# EAGLE design TMK-EURO-0.1.1x (EAGLE 8.1.0)
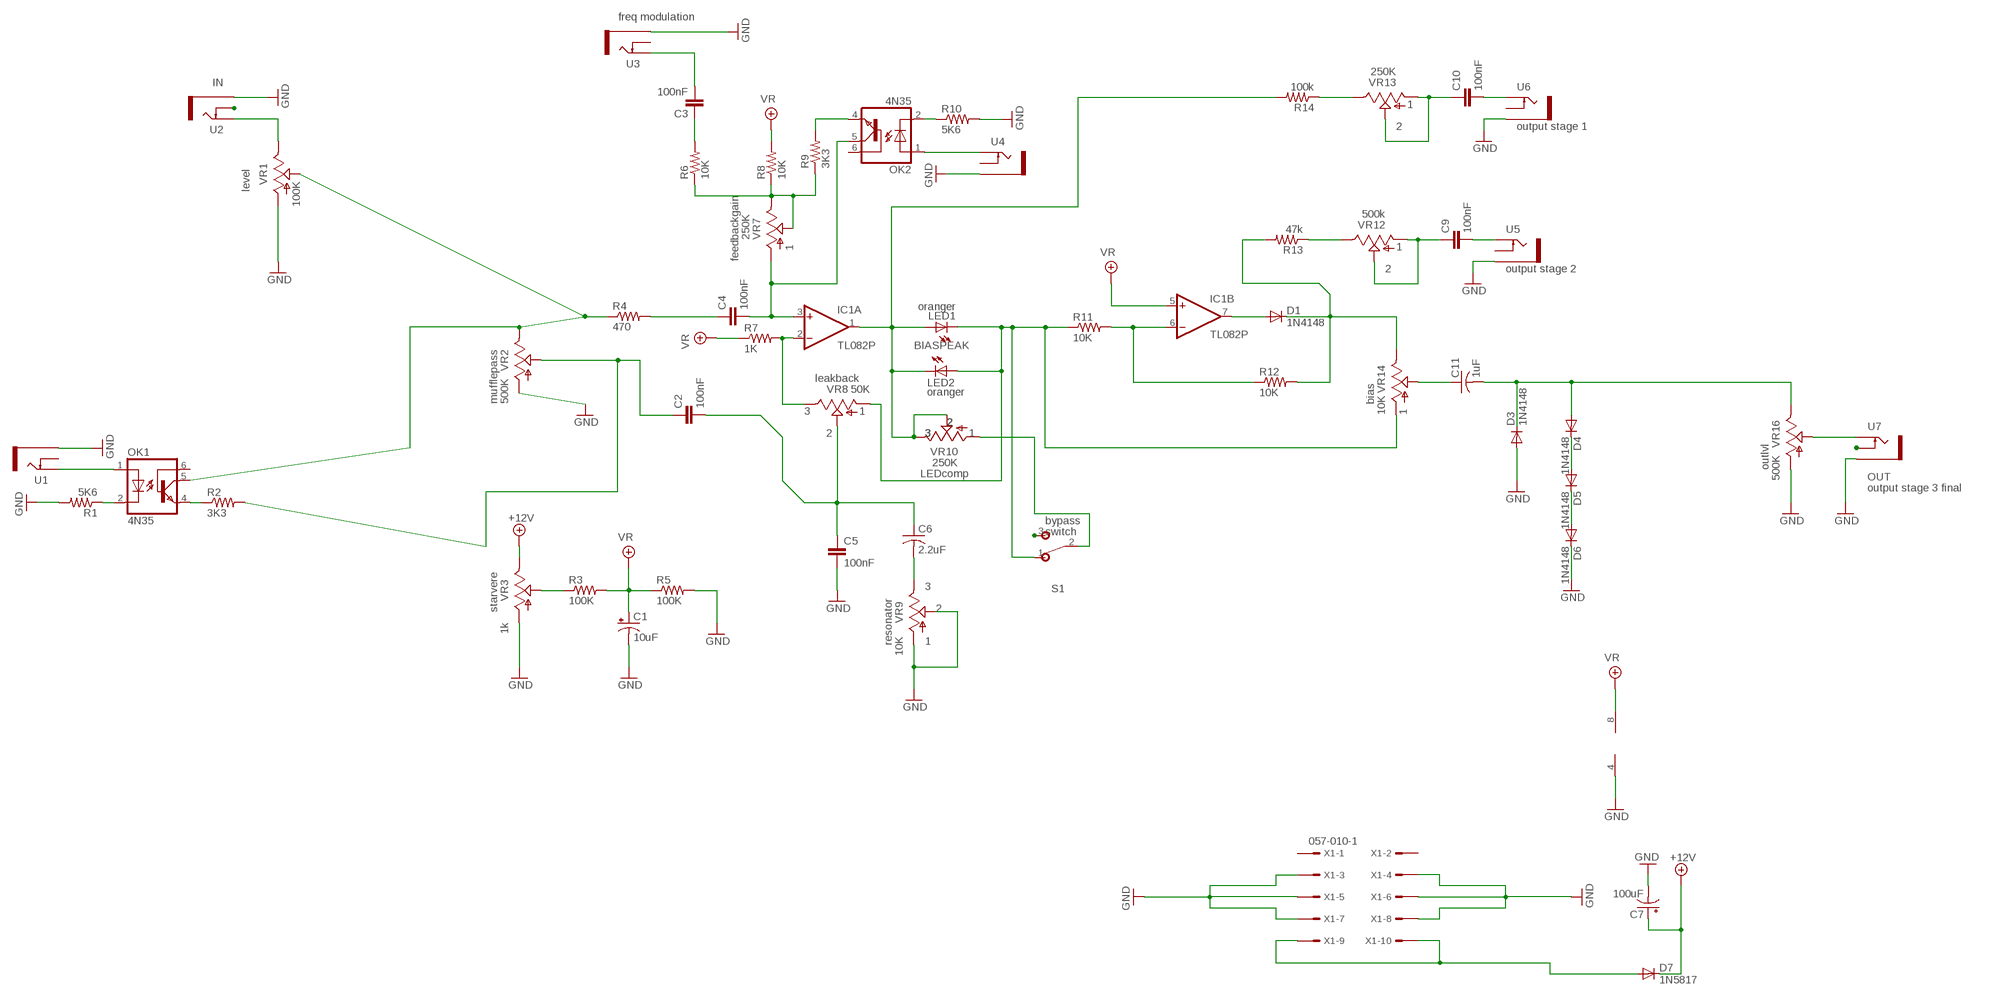
[diagram p0: schematic, sheet 1]

## Parts
C1  10uF  CPOL-USE2-5  [E2-5]
C2  100nF  C-EU050-035X075  [C050-035X075]
C3  100nF  C-EU050-035X075  [C050-035X075]
C4  100nF  C-EU050-035X075  [C050-035X075]
C5  100nF  C-EU050-035X075  [C050-035X075]
C6  2.2uF  C-US050-030X075  [C050-030X075]
C7  100uF  080  [080_035]
C9  100nF  C-EU050-035X075  [C050-035X075]
C10  100nF  C-EU050-035X075  [C050-035X075]
C11  1uF  C-US050-075X075  [C050-075X075]
D1  1N4148  SMALL_DIODEDO35-7  [DO35-7]
D3  1N4148  SMALL_DIODEDO35-7  [DO35-7]
D4  1N4148  SMALL_DIODEDO35-7  [DO35-7]
D5  1N4148  SMALL_DIODEDO35-7  [DO35-7]
D6  1N4148  SMALL_DIODEDO35-7  [DO35-7]
D7  1N5817  SMALL_DIODEDO35-7  [DO35-7]
IC1  TL082P  [DIL08]
LED1  oranger  LED3MM  [LED3MM]
LED2  oranger  LED3MM  [LED3MM]
OK1  4N35  [DIL06]
OK2  4N35  [DIL06]
R1  5K6  R-US_0207/7  [0207/7]
R2  3K3  R-US_0207/7  [0207/7]
R3  100K  R-US_0207/7  [0207/7]
R4  470  R-US_0207/7  [0207/7]
R5  100K  R-US_0207/7  [0207/7]
R6  10K  R-US_0207/7  [0207/7]
R7  1K  R-US_0207/7  [0207/7]
R8  10K  R-US_0207/7  [0207/7]
R9  3K3  R-US_0207/7  [0207/7]
R10  5K6  R-US_0207/7  [0207/7]
R11  10K  R-US_0207/7  [0207/7]
R12  10K  R-US_0207/7  [0207/7]
R13  47k  R-US_0207/7  [0207/7]
R14  100k  R-US_0207/7  [0207/7]
S1  SPDTPADS  [SPDT]
U1  IN  THONKICONNOLD  [THONKICONN]
U2  IN  THONKICONNOLD  [THONKICONN]
U3  IN  THONKICONNOLD  [THONKICONN]
U4  IN  THONKICONNOLD  [THONKICONN]
U5  IN  THONKICONNOLD  [THONKICONN]
U6  IN  THONKICONNOLD  [THONKICONN]
U7  THONKICONNOLD  [THONKICONN]
VR1  100K  9MM_SNAP-IN_POT_  [9MM_SNAP-IN_POT]
VR2  500K  9MM_SNAP-IN_POT_  [9MM_SNAP-IN_POT]
VR3  1k  9MM_SNAP-IN_POT_  [9MM_SNAP-IN_POT]
VR7  250K  9MM_SNAP-IN_POT_  [9MM_SNAP-IN_POT]
VR8  50K  9MM_SNAP-IN_POT_  [9MM_SNAP-IN_POT]
VR9  10K  9MM_SNAP-IN_POT_  [9MM_SNAP-IN_POT]
VR10  250K  9MM_SNAP-IN_POT_  [9MM_SNAP-IN_POT]
VR12  500k  9MM_SNAP-IN_POT_  [9MM_SNAP-IN_POT]
VR13  250K  9MM_SNAP-IN_POT_  [9MM_SNAP-IN_POT]
VR14  10K  9MM_SNAP-IN_POT_  [9MM_SNAP-IN_POT]
VR16  500K  9MM_SNAP-IN_POT_  [9MM_SNAP-IN_POT]
X1  057-010-1  [057-010-1]

## Nets
+12V [power]: C7.+ D7.C VR3.3(E)
BYPASS: S1.2(P) VR10.1(A)
GND [power]: C1.- C5.2 C7.- D3.A D6.C IC1.4(P:V-) R1.2 R5.2 R10.2 U1.P$1_SLEEVE(SLEEVE) U2.P$1_SLEEVE(SLEEVE) U3.P$1_SLEEVE(SLEEVE) U4.P$1_SLEEVE(SLEEVE) U5.P$1_SLEEVE(SLEEVE) U6.P$1_SLEEVE(SLEEVE) U7.P$1_SLEEVE(SLEEVE) VR1.1(A) VR2.1(A) VR3.1(A) VR9.1(A) VR9.2(S) VR16.1(A) X1.3 X1.4 X1.5 X1.6 X1.7 X1.8
IN [audio]: U2.P$3_TIP(TIP) VR1.3(E)
N$1: U2.P$2_SWITCH(SWITCH)
N$2 [audio]: OK1.5(COL) R4.1 VR1.2(S) VR2.3(E)
N$3 [audio]: C4.1 R4.2
N$4 [audio]: C4.2 IC1.3(A:+IN) OK2.5(COL) VR7.1(A)
N$5: R6.1 R8.1 R9.1 VR7.2(S) VR7.3(E)
N$6 [audio]: IC1.2(A:-IN) R7.2 VR8.3(E)
N$7 [power]: LED1.K(C) LED2.A R11.1 S1.1(O) VR8.1(A) VR14.1(A)
N$8: C6.2 VR9.3(E)
N$9 [audio]: C2.1 R2.2 VR2.2(S)
N$10 [audio]: IC1.1(A:OUT) LED1.A LED2.K(C) R14.2 VR10.2(S) VR10.3(E)
N$11 [power]: C2.2 C5.1 C6.1 VR8.2(S)
N$12 [audio]: IC1.6(B:-IN) R11.2 R12.1
N$13 [audio]: D1.C R12.2 R13.2 VR14.3(E)
N$14: D1.A IC1.7(B:OUT)
N$16: R14.1 VR13.3(E)
N$17: R13.1 VR12.3(E)
N$18 [audio]: C11.1 VR14.2(S)
N$19 [audio]: U7.P$3_TIP(TIP) VR16.2(S)
N$20 [audio]: C11.2 D3.C D4.A VR16.3(E)
N$21: D4.C D5.A
N$22: D5.C D6.A
N$23 [power]: R3.1 VR3.2(S)
N$24: U7.P$2_SWITCH(SWITCH)
N$25 [audio]: C10.2 U6.P$3_TIP(TIP)
N$27: OK2.4(EMI) R9.2
N$28: OK2.2(C) R10.1
N$30: OK2.1(A) U4.P$3_TIP(TIP)
N$31: OK1.4(EMI) R2.1
N$32: OK1.2(C) R1.1
N$33: OK1.1(A) U1.P$3_TIP(TIP)
N$34: S1.3(S)
N$35 [audio]: C9.2 U5.P$3_TIP(TIP)
N$36: C3.1 R6.2
N$37: C3.2 U3.P$3_TIP(TIP)
N$38: D7.A X1.9 X1.10
OUTPUT1 [audio]: C10.1 VR13.1(A) VR13.2(S)
OUTPUT2: C9.1 VR12.1(A) VR12.2(S)
VR [power]: C1.+ IC1.5(B:+IN) IC1.8(P:V+) R3.2 R5.1 R7.1 R8.2
Unconnected: OK1.6(BAS) OK2.6(BAS) U1.P$2_SWITCH(SWITCH) U3.P$2_SWITCH(SWITCH) U4.P$2_SWITCH(SWITCH) U5.P$2_SWITCH(SWITCH) U6.P$2_SWITCH(SWITCH) X1.1 X1.2

## Notes on the sheet
- freq modulation
- IN
- 1
- 2 | output stage 1
- level
- 1 | 1
- feedbackgain
- 2 | output stage 2
- BIASPEAK
- leakback
- mufflepass | bias
- 3 | 1 | 1
- 2 | 2
- 2 | 3 | 3 | 1
- LEDcomp | outlvl
- OUT
- output stage 3 final
- bypass
- switch
- 3
- starvere | 2
- resonator | 1

## Library data of the parts
C1 = adafruit:CPOL-US: POLARIZED CAPACITOR, American symbol
C2-C5 C9 C10 = rcl:C-EU: CAPACITOR, European symbol
C6 C11 = adafruit:C-US: CAPACITOR, American symbol
C7 = gm-caps-electro-pol:080: 47 - 470uF Xicon values at Mouser.com 10V: 330, 470uF; 16V: 220, 330uF; 25V: 220uF; 50V: 47, 100uF
D1 D3-D7 = MusicThingModular:SMALL_DIODE: Small Signal Diode
IC1 = linear:TL082: OP AMP Data sheet <http://www.ti.com/lit/ds/symlink/tl084a . pdf>; DATA_SHEET: <a href="http://www.ti.com/lit/ds/symlink/tl084a.pdf"> Data sheet </a>
LED1 LED2 = adafruit:LED: LED OSRAM: - CHIPLED LG R971, LG N971, LY N971, LG Q971, LY Q971, LO R971, LY R971 LH N974, LH R974 LS Q976, LO Q976, LY Q976 LO Q996 - Hyper CHIPLED LW Q18S LB Q993, LB Q99A, LB R99A - SideLED LS A670, LO A670, LY A670, LG A670, LP A670 LB A673, LV A673, LT A673, LW A673 LH A674 LY A675 LS A676, LA A676, LO A676, LY A676, LW A676 LS A679, LY A679, LG A679 - Hyper Micro SIDELED® LS Y876, LA Y876, LO Y876, LY Y876 LT Y87S - SmartLED LW L88C, LW L88S LB L89C, LB L89S, LG L890 LS L89K, LO L89K, LY L89K LS L896, LA L896, LO L896, LY L896 - TOPLED LS T670, LO T670, LY T670, LG T670, LP T670 LSG T670, LSP T670, LSY T670, LOP T670, LYG T670 LG T671, LOG T671, LSG T671 LB T673, LV T673, LT T673, LW T673 LH T674 LS T676, LA T676, LO T676, LY T676, LB T676, LH T676, LSB T676, LW T676 LB T67C, LV T67C, LT T67C, LS T67K, LO T67K, LY T67K, LW E67C LS E67B, LA E67B, LO E67B, LY E67B, LB E67C, LV E67C, LT E67C LW T67C LS T679, LY T679, LG T679 LS T770, LO T770, LY T770, LG T770, LP T770 LB T773, LV T773, LT T773, LW T773 LH T774 LS E675, LA E675, LY E675, LS T675 LS T776, LA T776, LO T776, LY T776, LB T776 LHGB T686 LT T68C, LB T68C - Hyper Mini TOPLED® LB M676 - Mini TOPLED Santana® LG M470 LS M47K, LO M47K, LY M47K Source: http://www.osram.convergy.de/
OK1 OK2 = optocoupler:4N35: MOTOROLA OPTO COUPLER; MF: FAIRCHILD SEMICONDUCTOR; MPN: 4N35; OC_FARNELL: 1328375; OC_NEWARK: 72K9946
R1-R14 = adafruit:R-US_: RESISTOR, American symbol
S1 = momentswitchREDlveewrergalmoer mini switch:SPDT: TOGGLE SWITCH Marquardt
U1-U7 = MusicThingModular:THONKICONN: 3.5mm socket for Eurorack modular synths
VR1-VR3 VR7-VR10 VR12-VR14 VR16 = MusicThingModular:9MM_SNAP-IN_POT: 9mm vertical snap-in pot, Alpha / Panasonic style
X1 = con-panduit:057-010-: CONNECTOR 10-pin series 057 contact pc board low profile headers; OC_FARNELL: unknown; OC_NEWARK: unknown

## Net classes
1 power: width 0.305 mm, drill 0.305 mm
2 audio: width 0.305 mm, drill 0.305 mm

## Board
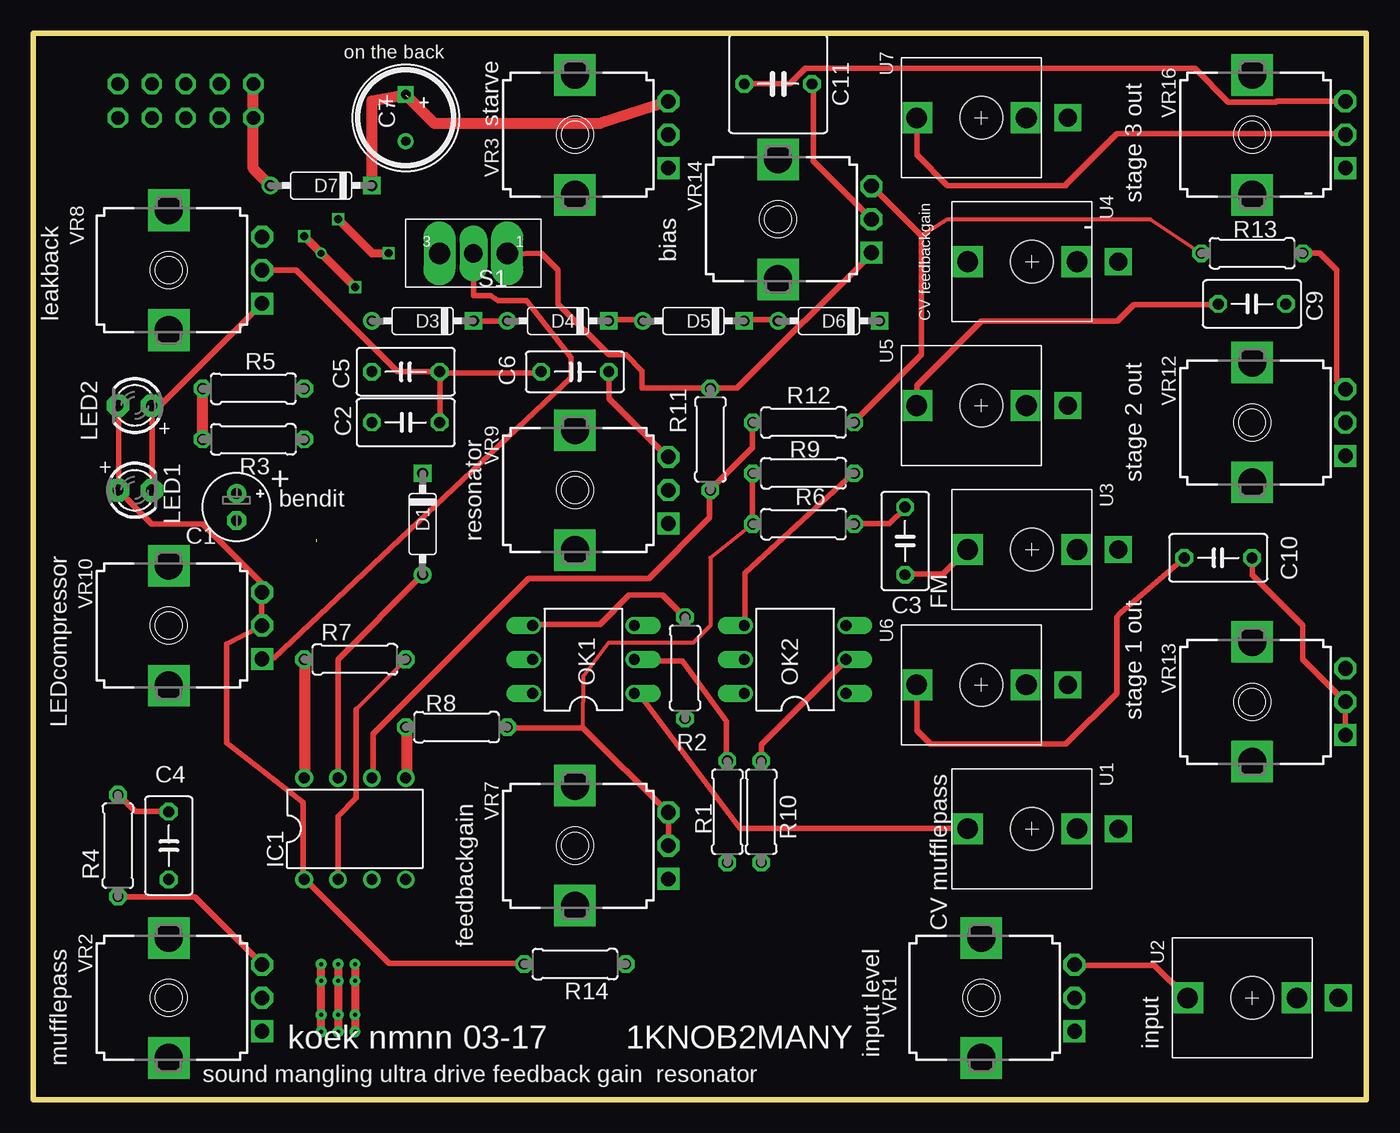
[diagram p1: board, top side]
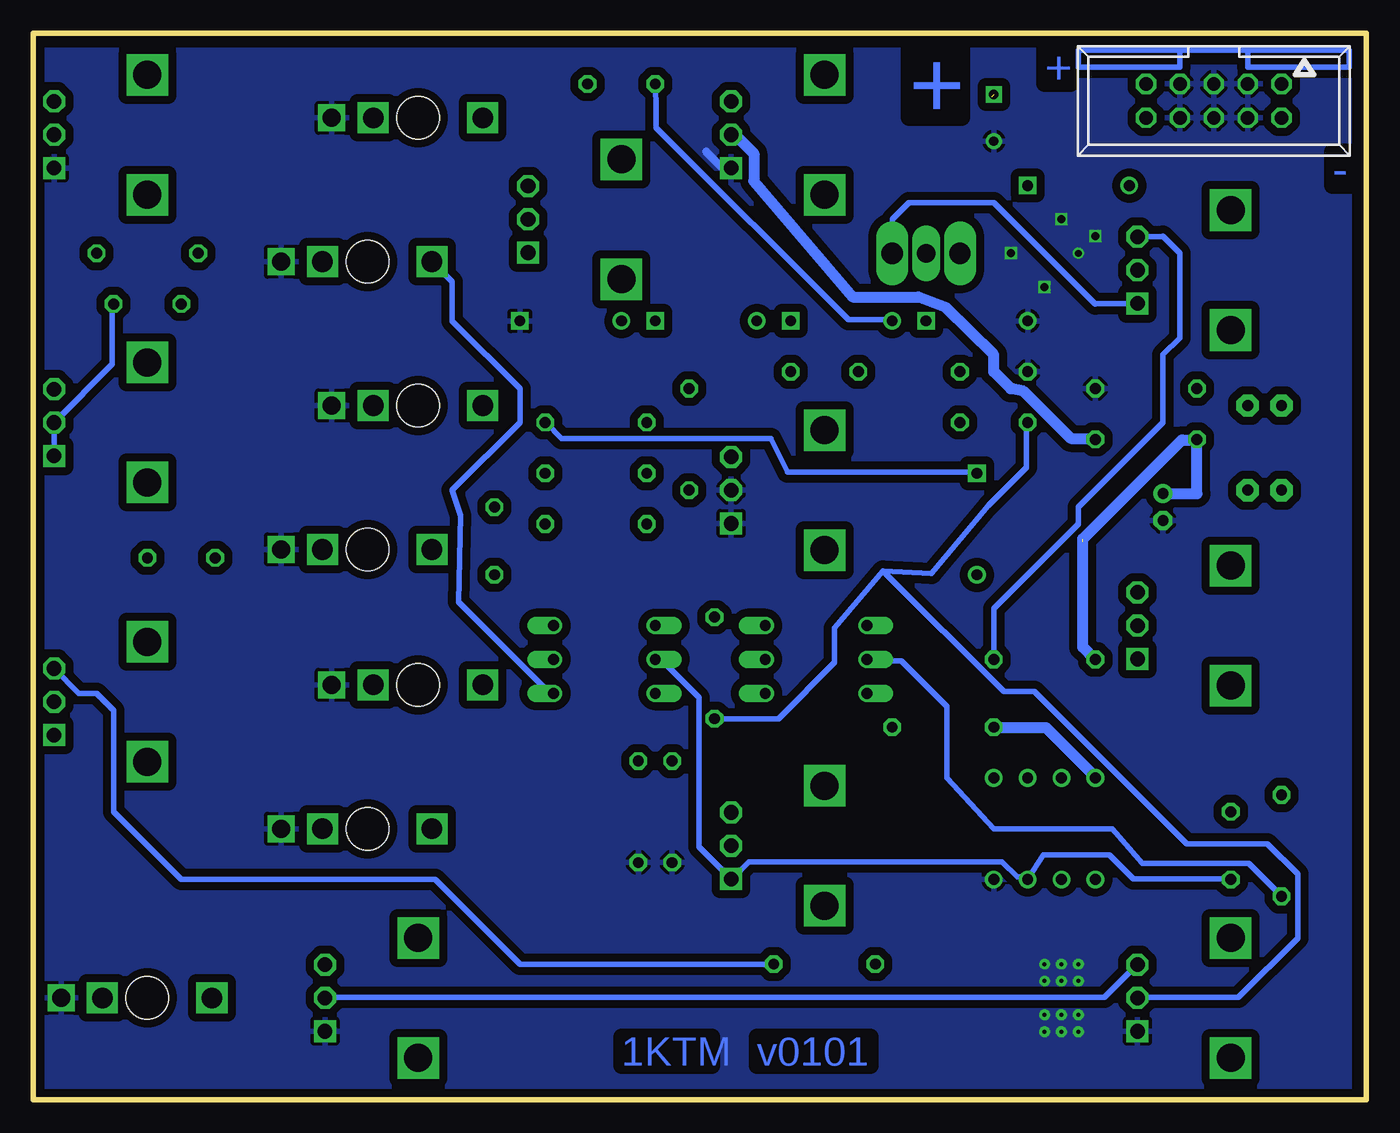
[diagram p2: board, bottom side, seen from below]

Size 100 x 80 mm. Coordinates in mm from the lower left corner, seen from the top.
Outline: 0,0 100,0 100,80 0,80 0,0
Copper layers (1*16): Top 0.035mm / dielectric 1.5mm / Bottom 0.035mm
Design rules "ITead_rule": minimum track width 6mil, minimum drill 12mil, track to track 6mil, track to pad 6mil, pad to pad 6mil, via to via 6mil, smd to smd 0mil, copper to edge 10mil, drill to drill 10mil, minimum pad ring 10mil, minimum via ring 6mil, stop-mask expansion 2mil, vias tented up to drill 100mil, thermal gap 10mil
Holes 3.2 mm at 71.12,31.11 71.12,52.07 71.12,73.66 91.44,7.62 74.93,20.32 74.93,41.27 74.93,62.87

### Footprints (pad centres in the part's own frame; a part is rotated, then mirrored left to right if it is on the bottom)
E2-5 = drill 0.813 pad 1.422: + -1.016,0 | drill 0.813 pad 1.422 octagon: - 1.016,0
C050-035X075 = drill 0.813 octagon: 1 -2.54,0; 2 2.54,0
C050-030X075 = drill 0.813 octagon: 1 -2.54,0; 2 2.54,0
080_035 = drill 0.7 square: + -1.75,0 | drill 0.7: - 1.75,0
C050-075X075 = drill 0.813 octagon: 1 -2.54,0; 2 2.54,0
DO35-7 = drill 0.813: A 3.81,0 | drill 0.813 square: C -3.81,0
DIL08 = drill 0.813 pad 1.27: 1 -3.81,-3.81; 2 -1.27,-3.81; 3 1.27,-3.81; 4 3.81,-3.81; 5 3.81,3.81; 6 1.27,3.81; 7 -1.27,3.81; 8 -3.81,3.81
LED3MM = drill 0.813 pad 1.676 octagon: A -1.27,0; K 1.27,0
DIL06 = drill 0.813 offset: 1 -2.54,-3.81; 2 0,-3.81; 3 2.54,-3.81; 4 2.54,3.81; 5 0,3.81; 6 -2.54,3.81
0207/7 = drill 0.813 octagon: 1 -3.81,0; 2 3.81,0
SPDT = drill 1.6 pad 2 long: 1 -2.54,0; 3 2.54,0 | drill 1.4 pad 2 long: 2 0,0
THONKICONN = drill 1.35 square: P$1_SLEEVE 0,-6.48 | drill 1.55 square: P$2_SWITCH 0,-3.38; P$3_TIP 0,4.84
9MM_SNAP-IN_POT = drill 1.1 square: 1 -2.5,-7 | drill 1.1 octagon: 2 0,-7; 3 2.5,-7 | drill 2.1 square: CHASSIS1 -4.5,0; CHASSIS2 4.5,0
057-010-1 = drill 1 octagon: 1 -5.08,-1.27; 2 -5.08,1.27; 3 -2.54,-1.27; 4 -2.54,1.27; 5 0,-1.27; 6 0,1.27; 7 2.54,-1.27; 8 2.54,1.27; 9 5.08,-1.27; 10 5.08,1.27

### Placement (x,y rotation side)
C1  15.24,44.45 270 top
C2  27.94,50.8 0 top
C3  65.41,41.91 270 top
C4  10.16,19.05 270 top
C5  27.94,54.61 180 top
C6  40.64,54.61 0 top
C7  27.94,73.66 270 top
C9  91.44,59.69 180 top
C10  88.9,40.64 180 top
C11  55.88,76.2 180 top
D1  29.21,43.18 270 top
D3  29.21,58.42 180 top
D4  39.37,58.42 180 top
D5  49.53,58.42 180 top
D6  59.69,58.42 180 top
D7  21.59,68.58 180 top
IC1  24.13,20.32 0 top
LED1  7.62,45.72 0 top
LED2  7.62,52.07 180 top
OK1  41.27,33.02 90 top
OK2  57.15,33.02 90 top
R1  52.07,21.59 270 top
R2  48.9,32.38 270 top
R3  16.51,49.53 180 top
R4  6.35,19.05 90 top
R5  16.51,53.34 0 top
R6  57.78,43.18 0 top
R7  24.13,33.02 0 top
R8  31.75,27.94 180 top
R9  57.78,46.99 0 top
R10  54.61,21.59 270 top
R11  50.8,49.53 270 top
R12  57.78,50.8 0 top
R13  91.44,63.5 180 top
R14  40.64,10.16 180 top
S1  33.02,63.5 180 top
U1  74.93,20.32 90 top
U2  91.44,7.62 90 top
U3  74.93,41.27 90 top
U4  74.93,62.87 90 top
U5  71.12,52.07 90 top
U6  71.12,31.11 90 top
U7  71.12,73.66 90 top
VR1  71.12,7.62 90 top
VR2  10.16,7.62 90 top
VR3  40.64,72.39 90 top
VR7  40.64,19.05 90 top
VR8  10.16,62.23 90 top
VR9  40.64,45.72 90 top
VR10  10.16,35.56 90 top
VR12  91.44,50.8 90 top
VR13  91.44,29.84 90 top
VR14  55.88,66.04 90 top
VR16  91.44,72.39 90 top
X1  11.43,74.93 180 bottom

### Tracks (layer width: path | path; a pad name or v marks a point on that pad's centre or on a via)
+12V  (1 unrouted)
  Top 0.406: 47.55,74.87 VR3.3
  Top 0.813: 28.12,75.21 30.07,73.25 42.52,73.25 VR3.3 | C7.+ 25.4,74.93 D7.C
BYPASS
  Top 0.406: VR10.1 17.26,33.15 18.06,33.15 40.36,54.18 40.36,55.65 37.01,59.96 34.85,59.96 34.29,60.33 33.02,60.33 S1.2
GND  (via drill 0.3 pad 0.81, 0.5 pad 0.81, 0.6 pad 0.81)
  Top 0.61: v20.32,64.77 v21.59,63.5 v24.13,60.96 | v22.86,66.04 25.4,63.5 v26.67,63.5 | v21.59,5.08 v21.59,6.35 v21.59,8.89 v21.59,10.16 | v22.86,10.16 v22.86,8.89 v22.86,6.35 v22.86,5.08 | v24.13,10.16 v24.13,8.89 v24.13,6.35 v24.13,5.08
  Bottom 0.61: VR3.1 48.3,69.89 49.53,71.12
  pour Bottom (isolate 0.61): 1.27,77.47 1.27,0 99.06,0.64 99.06,78.74 24.13,78.74 24.13,77.47
IN
  Top 0.406: VR1.3 78.18,10.06 84.12,10.06 86.53,7.66 U2.P$3_TIP
N$2
  Top 0.406: R4.1 6.4,15.2 12.12,15.2 17.14,10.17 VR2.3
  Bottom 0.406: OK1.5 37.38,32.92 34.86,32.92 31.45,29.51 31.45,24.13 27.94,20.32 19.05,20.32 16.79,17.72 8.8,17.72 6.4,15.32 R4.1 | VR1.2 78.07,7.66 19.66,7.66 17.26,10.06 VR2.3
N$3
  Top 0.406: C4.1 10.06,21.6 7.66,21.6 6.4,22.86 R4.2
N$4
  Bottom 0.406: C4.2 10.17,16.57 17.48,16.57 19.25,18.35 24.23,18.35 25.38,16.57 IC1.3 25.49,16.69 26.18,16.69 27.32,17.83 46.29,17.83 47.55,16.57 VR7.1 47.66,16.57 50.06,18.97 50.06,30.18 52.81,32.92 53.26,32.92 OK2.5
N$5
  Top 0.305: R6.1 50.8,40.64 50.8,35.56 49.53,34.29 43.18,34.29 41.27,31.75 41.26,27.89
  Top 0.406: R9.1 53.95,46.98 53.95,43.2 R6.1 53.95,43.09 | R8.1 35.66,27.89 41.26,27.89 47.55,21.6 VR7.3 47.66,21.49 47.66,19.09 VR7.2
N$6
  Top 0.305: R7.2 27.94,32.97 24.23,29.26
  Top 0.406: IC1.2 22.86,21.25 24.23,22.62 24.23,29.26 | 27.89,32.92 R7.2
  Bottom 0.406: 27.89,33.03 R7.2 27.94,36.83 21.59,43.18 21.59,44.45 15.24,50.8 15.24,55.88 13.97,57.15 13.97,63.5 15.24,64.77 15.24,64.73 VR8.3
N$7
  Top 0.406: VR14.1 62.87,63.44 52.81,53.38 50.86,53.38 R11.1 50.75,53.38 45.68,53.38 45.68,54.65 44.45,55.88 43.18,55.88 39.37,59.69 39.37,62.23 38.1,63.5 35.66,63.44 S1.1 35.55,63.55 | LED1.K 8.91,45.72 8.91,52.01 LED2.A 9.5,52.07 VR8.1
  Bottom 0.305: 20.28,59.73 20.32,59.69
  Bottom 0.406: VR8.1 20.28,59.73 | S1.1 35.56,66.04 34.29,67.31 27.94,67.31 20.32,59.69
N$8
  Top 0.406: C6.2 43.2,54.52 43.2,52.58 47.55,48.23 VR9.3
N$9
  Bottom 0.406: R2.2 44.11,28.57 39.9,32.78 39.9,35.37 36.24,39.67 | 36.24,39.67 32.61,39.48 28.35,44.56 25.49,47.42 25.49,50.75 C2.1 | 36.24,39.67 27.19,30.62 24.91,30.62 13.47,19.19 7.4,19.19 5.14,16.93 5.14,12.1 9.59,7.66 17.14,7.66 VR2.2
N$10
  Top 0.406: LED2.K 6.4,52.01 6.4,45.72 LED1.A 8.89,43.18 12.7,43.18 17.16,38.72 VR10.3 | R14.2 36.8,10.22 26.7,10.22 20.46,16.46 IC1.1 20.23,16.57 20.23,22.29 14.5,26.75 14.5,34.18 17.14,35.55 VR10.2 17.14,35.66 17.14,37.95 VR10.3 | 17.03,38.06 VR10.3
N$11
  Top 0.305: 19.72,62.23 19.77,62.18
  Top 0.406: C2.2 30.52,50.86 30.52,54.52 C5.1 | C6.1 38.06,54.52 30.63,54.52 C5.1 | 19.77,62.18 27.32,54.63 30.4,54.63 C5.1 | VR8.2 19.72,62.23
N$12
  Top 0.406: IC1.6 25.49,24.23 25.49,27.43 37.15,39.09 46.18,39.09 50.75,43.66 50.75,45.72 R11.2 50.86,45.83 53.95,48.92 53.95,50.75 R12.1
N$13
  Top 0.305: 66.64,64.81 68.58,66.04 83.82,66.04 R13.2
  Top 0.406: R13.2 87.55,63.54 | VR14.3 62.98,68.47 66.64,64.81 66.64,55.89 61.61,50.86 R12.2
  Bottom 0.406: D1.C 29.26,47.09 43.42,47.09 44.67,49.61 60.35,49.61 61.49,50.75 R12.2
N$14
  Top 0.406: IC1.7 22.86,33.03 29.15,39.32 D1.A
N$15
  Bottom 0.406: 8.89,78.74 8.89,77.47 1.27,77.47 1.27,78.74 13.97,78.74 | 13.97,78.74 21.59,78.74 21.59,77.47 13.97,77.47 13.97,78.74
N$16
  Bottom 0.406: R14.1 60.96,10.16 63.5,10.16 69.85,16.51 86.36,16.51 88.9,16.51 93.98,21.59 93.98,29.21 95.25,30.48 96.58,30.48 VR13.3
N$17
  Top 0.406: R13.1 96.52,63.5 97.79,62.23 97.79,53.95 VR12.3
N$18
  Top 0.305: 58.52,70.41 58.42,70.41
  Top 0.406: VR14.2 62.87,66.06 58.52,70.41 58.52,76.2 C11.1
N$19
  Top 0.406: VR16.2 98.41,72.45 81.28,72.45 77.47,68.64 77.47,68.58 68.58,68.58 66.28,70.88 U7.P$3_TIP
N$20
  Top 0.406: D3.C 33.03,58.41 35.55,58.41 D4.A | C11.2 56.77,76.2 57.94,77.37 87.13,77.37 89.67,74.82 93.21,74.82 93.27,74.89 VR16.3
  Bottom 0.406: C11.2 53.26,74.87 53.26,72.92 38.86,58.52 35.66,58.52 D4.A | 98.41,74.85 VR16.3
N$21
  Top 0.406: D4.C 43.2,58.52 45.72,58.52 D5.A
N$22
  Top 0.406: D5.C 53.38,58.52 55.78,58.52 D6.A
N$23
  Bottom 0.406: 47.32,72.35 47.55,72.35 VR3.2 | 20.34,49.61 R3.1
  Bottom 0.813: 20.34,49.61 22.17,49.61 25.72,53.15 26.67,53.34 27.94,54.61 27.94,55.88 31.55,59.44 33.6,60.22 38.52,60.22 45.95,68.92 45.95,70.98 47.32,72.35
N$25
  Top 0.406: C10.2 81.57,36.49 81.28,36.2 81.28,30.48 77.47,26.67 67.31,26.67 66.28,27.7 U6.P$3_TIP
N$27
  Top 0.406: OK2.4 53.38,35.66 53.38,39.5 61.49,46.98 R9.2
N$28
  Top 0.406: R10.1 54.63,25.49 54.63,26.63 60.92,32.92 OK2.2
N$30
  Bottom 0.406: OK2.1 61.04,30.52 61.27,30.52 68.08,37.33 67.94,43.81 68.58,45.72 63.5,50.8 63.5,53.34 68.58,58.42 68.58,61.38 70.07,62.87 U4.P$3_TIP
N$31
  Top 0.406: OK1.4 37.49,35.66 42.51,35.66 44.69,37.85 47.19,37.85 48.81,36.23 R2.1
N$32
  Top 0.406: R1.1 52.01,25.49 52.01,28.36 48.72,32.92 45.15,32.92 OK1.2
N$33
  Top 0.406: OK1.1 45.15,30.4 45.49,30.4 53.01,20.34 70.07,20.34 U1.P$3_TIP
N$35
  Top 0.305: 81.28,58.42 81.32,58.42
  Top 0.406: C9.2 88.81,59.65 82.55,59.65 81.32,58.42 | 81.28,58.42 73.66,58.42 71.12,58.42 66.28,53.58 U5.P$3_TIP
N$36
  Top 0.406: R6.2 61.61,43.2 64.24,43.2 65.38,44.35 C3.1
N$37
  Top 0.406: C3.2 65.49,39.43 68.24,39.43 70.07,41.26 U3.P$3_TIP
N$38
  Top 0.813: D7.A 16.51,69.85 X1.10 X1.9
OUTPUT1
  Top 0.305: VR13.2 98.42,29.84
  Top 0.406: VR13.1 VR13.2 | 98.42,29.84 95.25,33.02 95.25,35.56 91.44,39.37 C10.1
OUTPUT2
  Top 0.406: VR12.2 98.53,50.85
  Bottom 0.152: VR12.2 97.84,50.8
  Bottom 0.406: C9.1 94.07,59.65 94.07,55.17 VR12.2 | 98.41,50.74 VR12.2 | 97.84,47.7 VR12.1 VR12.2
VR  (1 unrouted)
  Top 0.406: 12.69,49.61 R3.2 | 12.69,53.26 R5.1 | 28,24.23 IC1.5 | 28,27.89 R8.2 | 20.34,24.23 IC1.8 | 20.34,32.92 R7.1
  Top 0.813: 12.69,53.26 12.69,49.61 | 28,27.89 28,24.23 | 20.34,32.92 20.34,24.23
  Bottom 0.406: 20.34,33.03 R7.1 | 27.89,27.89 R8.2 | 20.34,24.23 IC1.8 | R3.2 12.8,49.49
  Bottom 0.813: 21.26,41.83 21.26,33.95 20.34,33.03 | 27.89,27.89 24,27.89 20.34,24.23 | 12.8,49.49 13.83,49.49 21.26,42.06 | C1.+ 12.7,45.47 R3.2

### Text on the board
Bottom: + | + | - | v0101 | 1KTM
tPlace: on the back | + | bendit | koek nmnn 03-17 | 1KNOB2MANY | sound mangling ultra drive feedback gain resonator
tNames: starve | stage 3 out | - | - | bias | leakback | CV feedbackgain | + | stage 2 out | resonator | FM | stage 1 out | LEDcompressor | CV mufflepass | feedbackgain | input | mufflepass | input level